# EAGLE design mbed Board (EAGLE 9.2.2)
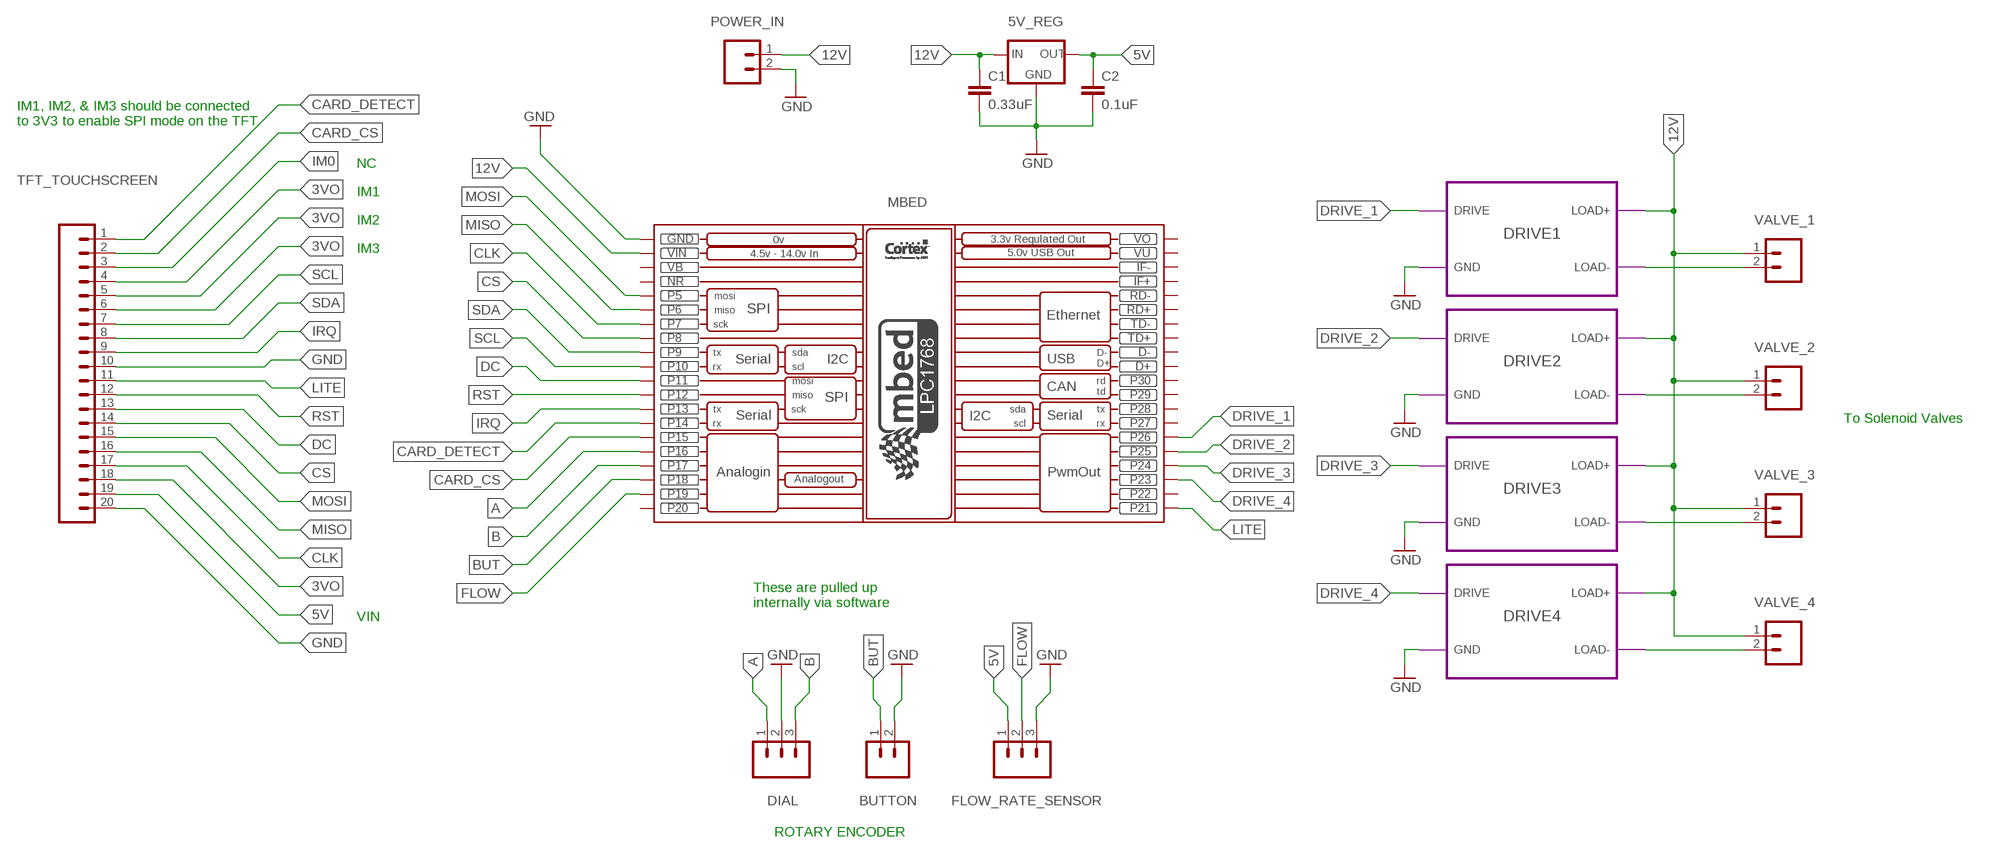
[diagram p0: schematic, sheet 1]

## Parts
5V_REG  5VREG_L7805_SINK  [TO-220-SINK]
BUTTON  M02  [1X02]
C1  0.33uF  CAPPTH  [CAP-PTH-SMALL]
C2  0.1uF  CAPPTH  [CAP-PTH-SMALL]
DIAL  M03  [1X03]
FLOW_RATE_SENSOR  M03  [1X03]
MBED  MBED_NXP_LPC1768  [MBED-KIT]
POWER_IN  M02  [1X02]
TFT_TOUCHSCREEN  M20  [1X20]
VALVE_1  M02  [1X02]
VALVE_2  M02  [1X02]
VALVE_3  M02  [1X02]
VALVE_4  M02  [1X02]

## Module instances
DRIVE1 = DRIVE
DRIVE2 = DRIVE
DRIVE3 = DRIVE
DRIVE4 = DRIVE

## Nets
3VO: TFT_TOUCHSCREEN.4 TFT_TOUCHSCREEN.5 TFT_TOUCHSCREEN.6 TFT_TOUCHSCREEN.18
5V: 5V_REG.3(OUT) C2.1 FLOW_RATE_SENSOR.1 TFT_TOUCHSCREEN.19
12V: 5V_REG.1(IN) C1.1 MBED.VIN POWER_IN.1 VALVE_1.1 VALVE_2.1 VALVE_3.1 VALVE_4.1 ; port DRIVE4.LOAD+ DRIVE3.LOAD+ DRIVE2.LOAD+ DRIVE1.LOAD+
A: DIAL.1 MBED.P$16(P16)
B: DIAL.3 MBED.P$17(P17)
BUT: BUTTON.1 MBED.P$18(P18)
CARD_CS: MBED.P$15(P15) TFT_TOUCHSCREEN.2
CARD_DETECT: MBED.P$14(P14) TFT_TOUCHSCREEN.1
CLK: MBED.P$7(P7) TFT_TOUCHSCREEN.17
CS: MBED.P$8(P8) TFT_TOUCHSCREEN.14
DC: MBED.P$11(P11) TFT_TOUCHSCREEN.13
DRIVE_1: MBED.P$26(P26) ; port DRIVE1.DRIVE
DRIVE_2: MBED.P$25(P25) ; port DRIVE2.DRIVE
DRIVE_3: MBED.P$24(P24) ; port DRIVE3.DRIVE
DRIVE_4: MBED.P$23(P23) ; port DRIVE4.DRIVE
FLOW: FLOW_RATE_SENSOR.2 MBED.P$19(P19)
GND: 5V_REG.2(GND) BUTTON.2 C1.2 C2.2 DIAL.2 FLOW_RATE_SENSOR.3 MBED.GND POWER_IN.2 TFT_TOUCHSCREEN.10 TFT_TOUCHSCREEN.20 ; port DRIVE1.GND DRIVE2.GND DRIVE3.GND DRIVE4.GND
IM0: TFT_TOUCHSCREEN.3
IRQ: MBED.P$13(P13) TFT_TOUCHSCREEN.9
LITE: MBED.P$21(P21) TFT_TOUCHSCREEN.11
MISO: MBED.P$6(P6) TFT_TOUCHSCREEN.16
MOSI: MBED.P$5(P5) TFT_TOUCHSCREEN.15
N$2: VALVE_2.2 ; port DRIVE2.LOAD-
N$3: VALVE_3.2 ; port DRIVE3.LOAD-
N$4: VALVE_4.2 ; port DRIVE4.LOAD-
N$5: VALVE_1.2 ; port DRIVE1.LOAD-
RST: MBED.P$12(P12) TFT_TOUCHSCREEN.12
SCL: MBED.P$10(P10) TFT_TOUCHSCREEN.7
SDA: MBED.P$9(P9) TFT_TOUCHSCREEN.8
Unconnected: MBED.D+ MBED.D- MBED.IF+ MBED.IF- MBED.P$20(P20) MBED.P$22(P22) MBED.P$27(P27) MBED.P$28(P28) MBED.P$29(P29) MBED.P$30(P30) MBED.RD+ MBED.RD- MBED.TD+ MBED.TD-

## Notes on the sheet
- IM1, IM2, & IM3 should be connected
  to 3V3 to enable SPI mode on the TFT
- NC
- IM1
- IM2
- IM3
- To Solenoid Valves
- These are pulled up
  internally via software
- VIN
- ROTARY ENCODER

## Power pins joined to a net without a drawn wire
NR: MBED.NR
VB: MBED.VB
VO: MBED.VOUT(VO)
VU: MBED.VU

## Library data of the parts
5V_REG = HyTechDevices:5VREG_L7805: Voltage Regulator Switching 5v regulator Datasheet <http://power.murata.com/data/power/oki-78sr.pdf> Standard 7805 5V regulator. IGO (Input Ground Output). Spark Fun Electronics SKU : COM-00107 Datasheet <http://www.mouser.com/ds/2/308/MC7800-D-94905.pdf>
BUTTON POWER_IN VALVE_1-VALVE_4 = HyTechDevices:M02: Standard 2-pin 0.1" header. NOTES ON THE VARIANTS LOCK and LOCK_LONGPADS... This footprint was designed to help hold the alignment of a through-hole component (i.e. 6-pin header) while soldering it into place. You may notice that each hole has been shifted either up or down by 0.005 of an inch from it's more standard position (which is a perfectly straight line). This slight alteration caused the pins (the squares in the middle) to touch the edges of the holes. Because they are alternating, it causes a "brace" to hold the component in place. 0.005 has proven to be the perfect amount of "off-center" position when using our standard breakaway headers. Although looks a little odd when you look at the bare footprint, once you have a header in there, the alteration is very hard to notice. Also,if you push a header all the way into place, it is covered up entirely on the bottom side. This idea of altering the position of holes to aid alignment will be further integrated into the Sparkfun Library for other footprints. It can help hold any component with 3 or more connection pins. Note: The Sparkfun version includes many other packages including surface mount that may be of future interest. Source: Sparkfun <https://github.com/sparkfun/SparkFun-Eagle-Libraries>
C1 C2 = HyTechDevices:CAP: Capacitor Standard 0603 ceramic capacitor, and 0.1" leaded capacitor.
DIAL FLOW_RATE_SENSOR = HyTechDevices:M03: Standard 3-pin 0.1" header.
MBED = mbed:MBED_NXP_LPC1768: Mbed LPC1768 - ARM CORTEX v2.1 * Schematic symbol is now placed in eagles's default raster. *The pads diameter are suitable for routing between mbed pins * mbed pads are 0.8 mm drill diameter. --------------------------------------------- Created by: Mohamed Yousry *Alexandria, Egypt *Email: mohamed.yousry@ieeegoldegypt.org
TFT_TOUCHSCREEN = HyTechDevices:M20: 1x20 .1" header This is just like the LOCK variant in that the holes are staggared by 5 mil, but except for the last two holes. They are not altered from the "standard" footprint layout. This is used for a special purpose on the layout of our Graphic LCD Backpack. Make sure you want to use this device before selecting it for you project! Source: Sparkfun <https://github.com/sparkfun/SparkFun-Eagle-Libraries>

## Module DRIVE
Ports: DRIVE(in) GND(pwr) LOAD+(pwr) LOAD-(pwr)
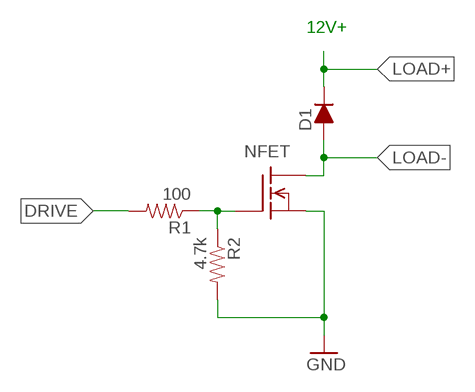
[diagram p1: schematic, module DRIVE, sheet 1]

### Parts
D1  DIODEDO-41  [DO-41]
NFET  N-CHANNEL_MOSFETGENERIC  [TO-220-SINK]
R1  100  RESISTORPTH-1/4W  [AXIAL-0.4]
R2  4.7k  RESISTORPTH-1/4W  [AXIAL-0.4]

### Nets
DRIVE: R1.P$2
GND: NFET.3(S) R2.P$2
LOAD+: D1.C
LOAD-: D1.A NFET.2(D)
N$4: NFET.1(G) R1.P$1 R2.P$1

### Notes on the sheet
- 12V+

### Library data of the parts
D1 = HyTechDevices:DIODE: DIODE general purpose rectifier
NFET = HyTechDevices:N-CHANNEL_MOSFET: Generic N-Channel MOSFET; _EXTERNAL_: 1
R1 R2 = HyTechDevices:RESISTOR: Resistor Basic schematic elements and footprints for 0603, 1206, and PTH resistors.

## Board
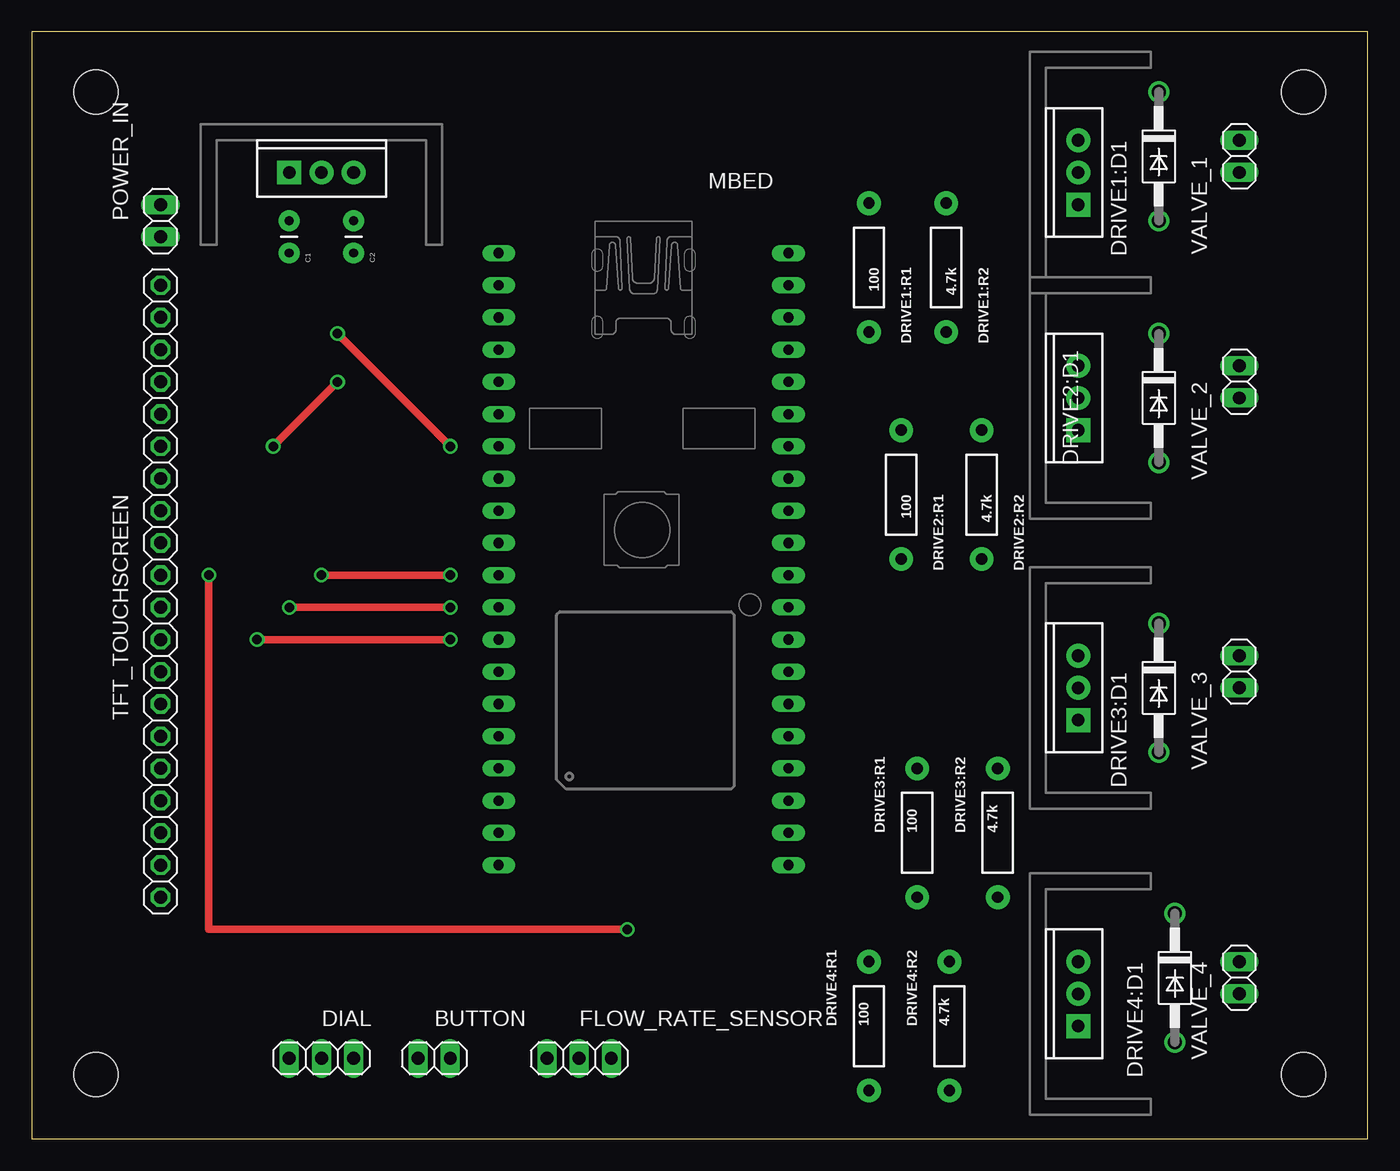
[diagram p2: board, top side]
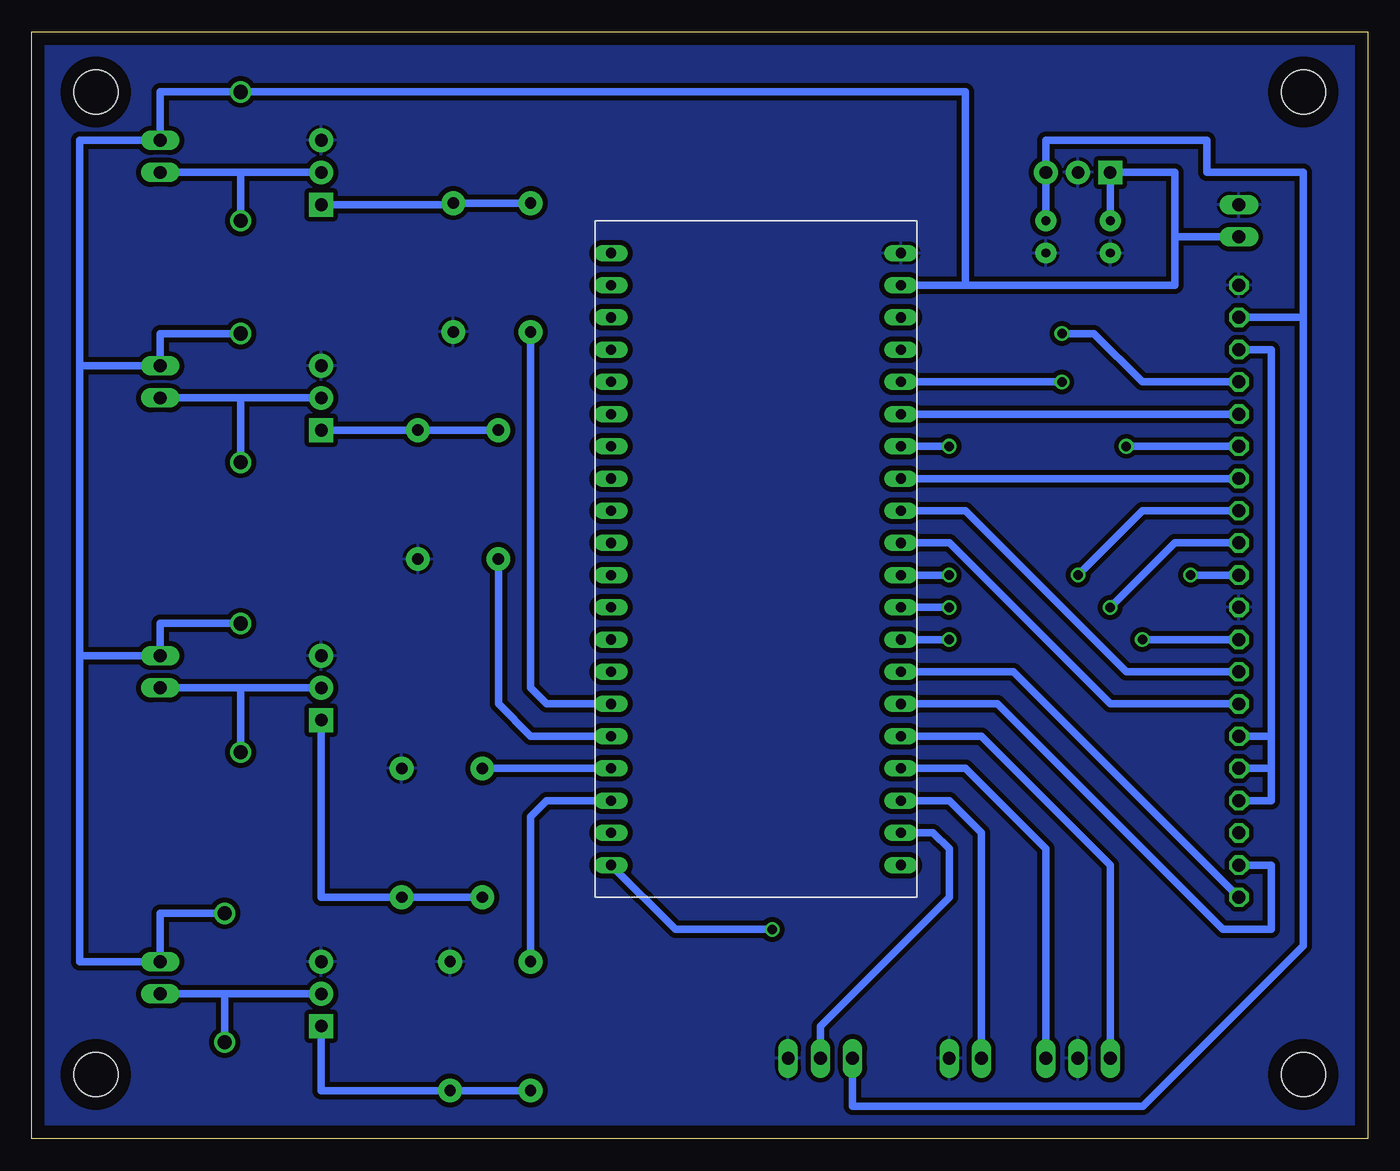
[diagram p3: board, bottom side, seen from below]

Size 105.39 x 87.3 mm. Coordinates in mm from the lower left corner, seen from the top.
Outline: 0,0 105.39,0 105.39,87.3 0,87.3 0,0
Copper layers (1*16): Top 0.035mm / dielectric 1.5mm / Bottom 0.035mm
Design rules "default *": minimum track width 6mil, minimum drill 0.35mm, track to track 15mil, track to pad 15mil, pad to pad 15mil, via to via 15mil, smd to smd 15mil, copper to edge 40mil, drill to drill 6mil, minimum pad ring 10mil, minimum via ring 8mil, stop-mask expansion 4mil, vias tented up to drill 0mil, thermal gap 10mil
Holes 3.5 mm at 5.08,82.55 100.33,82.55 100.33,5.08 5.08,5.08

### Footprints (pad centres in the part's own frame; a part is rotated, then mirrored left to right if it is on the bottom)
TO-220-SINK = drill 1 pad 1.88 square: 1 -2.54,0 | drill 1 pad 1.88: 2 0,0; 3 2.54,0
1X02 = drill 1.016 long: 1 -1.27,0; 2 1.27,0
CAP-PTH-SMALL = drill 0.7 pad 1.651: 1 0,0; 2 2.54,0
1X03 = drill 1.016 long: 1 -2.54,0; 2 0,0; 3 2.54,0
DO-41 = drill 1.118: A 5.08,0; C -5.08,0
AXIAL-0.4 = drill 0.9 pad 1.88: P$1 -5.08,0; P$2 5.08,0
MBED-KIT = drill 0.8 long: D+ 11.43,1.27; D- 11.43,3.81; GND -11.43,24.13; IF+ 11.43,16.51; IF- 11.43,19.05; NR -11.43,16.51; P$5 -11.43,13.97; P$6 -11.43,11.43; P$7 -11.43,8.89; P$8 -11.43,6.35; P$9 -11.43,3.81; P$10 -11.43,1.27; P$11 -11.43,-1.27; P$12 -11.43,-3.81; P$13 -11.43,-6.35; P$14 -11.43,-8.89; P$15 -11.43,-11.43; P$16 -11.43,-13.97; P$17 -11.43,-16.51; P$18 -11.43,-19.05; P$19 -11.43,-21.59; P$20 -11.43,-24.13; P$21 11.43,-24.13; P$22 11.43,-21.59; P$23 11.43,-19.05; P$24 11.43,-16.51; P$25 11.43,-13.97; P$26 11.43,-11.43; P$27 11.43,-8.89; P$28 11.43,-6.35; P$29 11.43,-3.81; P$30 11.43,-1.27; RD+ 11.43,11.43; RD- 11.43,13.97; TD+ 11.43,6.35; TD- 11.43,8.89; VB -11.43,19.05; VIN -11.43,21.59; VOUT 11.43,24.13; VU 11.43,21.59
1X20 = drill 1.016 octagon: 1 0,0; 2 2.54,0; 3 5.08,0; 4 7.62,0; 5 10.16,0; 6 12.7,0; 7 15.24,0; 8 17.78,0; 9 20.32,0; 10 22.86,0; 11 25.4,0; 12 27.94,0; 13 30.48,0; 14 33.02,0; 15 35.56,0; 16 38.1,0; 17 40.64,0; 18 43.18,0; 19 45.72,0; 20 48.26,0

### Placement (x,y rotation side)
5V_REG  22.86,76.2 0 top
BUTTON  31.75,6.35 0 top
C1  20.32,72.39 270 top
C2  25.4,72.39 270 top
DIAL  22.86,6.35 0 top
DRIVE1:D1  [DO-41]  88.9,77.47 270 top
DRIVE1:NFET  N-CHANNEL_MOSFETGENERIC  [TO-220-SINK]  82.55,76.2 90 top
DRIVE1:R1  100  [AXIAL-0.4]  66.04,68.71 270 top
DRIVE1:R2  4.7k  [AXIAL-0.4]  72.14,68.71 270 top
DRIVE2:D1  [DO-41]  88.9,58.42 270 top
DRIVE2:NFET  N-CHANNEL_MOSFETGENERIC  [TO-220-SINK]  82.55,58.42 90 top
DRIVE2:R1  100  [AXIAL-0.4]  68.58,50.8 270 top
DRIVE2:R2  4.7k  [AXIAL-0.4]  74.93,50.8 270 top
DRIVE3:D1  [DO-41]  88.9,35.56 270 top
DRIVE3:NFET  N-CHANNEL_MOSFETGENERIC  [TO-220-SINK]  82.55,35.56 90 top
DRIVE3:R1  100  [AXIAL-0.4]  69.85,24.13 90 top
DRIVE3:R2  4.7k  [AXIAL-0.4]  76.2,24.13 90 top
DRIVE4:D1  [DO-41]  90.17,12.7 270 top
DRIVE4:NFET  N-CHANNEL_MOSFETGENERIC  [TO-220-SINK]  82.55,11.43 90 top
DRIVE4:R1  100  [AXIAL-0.4]  66.04,8.89 90 top
DRIVE4:R2  4.7k  [AXIAL-0.4]  72.39,8.89 90 top
FLOW_RATE_SENSOR  43.18,6.35 0 top
MBED  48.26,45.72 0 top
POWER_IN  10.16,72.39 90 top
TFT_TOUCHSCREEN  10.16,19.05 90 top
VALVE_1  95.25,77.47 270 top
VALVE_2  95.25,59.69 270 top
VALVE_3  95.25,36.83 270 top
VALVE_4  95.25,12.7 270 top

### Tracks (layer width: path | path; a pad name or v marks a point on that pad's centre or on a via)
3VO
  Bottom 0.61: TFT_TOUCHSCREEN.18 7.62,62.23 7.62,31.75 | 7.62,31.75 TFT_TOUCHSCREEN.6 | 7.62,31.75 7.62,29.21 | 7.62,29.21 7.62,26.67 TFT_TOUCHSCREEN.4 | 7.62,29.21 TFT_TOUCHSCREEN.5
5V
  Bottom 0.61: C2.1 5V_REG.3 25.4,78.74 12.7,78.74 12.7,76.2 5.08,76.2 5.08,64.77 | TFT_TOUCHSCREEN.19 5.08,64.77 | 5.08,64.77 5.08,15.24 17.73,2.59 40.64,2.59 FLOW_RATE_SENSOR.1
12V
  Bottom 0.61: C1.1 5V_REG.1 15.24,76.2 15.24,71.12 | 15.24,71.12 15.24,67.31 MBED.VIN 31.75,67.31 31.75,82.55 DRIVE1:D1.C 95.25,82.55 VALVE_1.1 101.6,78.74 101.6,60.96 | 101.6,60.96 101.6,38.1 | 101.6,38.1 101.6,13.97 VALVE_4.1 95.25,17.78 DRIVE4:D1.C | 101.6,38.1 VALVE_3.1 95.25,40.64 DRIVE3:D1.C | 101.6,60.96 VALVE_2.1 95.25,63.5 DRIVE2:D1.C | POWER_IN.1 15.24,71.12
A
  Bottom 0.61: DIAL.1 20.32,21.59 30.48,31.75 MBED.P$16
B
  Bottom 0.61: MBED.P$17 31.75,29.21 25.4,22.86 DIAL.3
BUT
  Bottom 0.61: BUTTON.1 30.48,24.13 33.02,26.67 MBED.P$18
CARD_CS
  Bottom 0.61: TFT_TOUCHSCREEN.2 7.62,21.59 7.62,16.51 11.43,16.51 29.21,34.29 MBED.P$15
CARD_DETECT
  Bottom 0.61: TFT_TOUCHSCREEN.1 27.94,36.83 MBED.P$14
CLK  (via drill 0.75)
  Top 0.61: v33.02,54.61 v24.13,63.5
  Bottom 0.61: TFT_TOUCHSCREEN.17 17.78,59.69 21.59,63.5 v24.13,63.5 | v33.02,54.61 MBED.P$7
CS
  Bottom 0.61: TFT_TOUCHSCREEN.14 MBED.P$8
DC  (via drill 0.75)
  Top 0.61: v22.86,44.45 v33.02,44.45
  Bottom 0.61: TFT_TOUCHSCREEN.13 17.78,49.53 v22.86,44.45 | v33.02,44.45 MBED.P$11
DRIVE1:N$4
  Bottom 0.61: DRIVE1:R1.P$1 DRIVE1:R2.P$1 72.26,73.66 DRIVE1:NFET.1
DRIVE2:N$4
  Bottom 0.61: DRIVE2:R2.P$1 DRIVE2:R1.P$1 DRIVE2:NFET.1
DRIVE3:N$4
  Bottom 0.61: DRIVE3:R1.P$1 DRIVE3:R2.P$1 82.55,19.05 DRIVE3:NFET.1
DRIVE4:N$4
  Bottom 0.61: DRIVE4:R1.P$1 DRIVE4:R2.P$1 82.55,3.81 DRIVE4:NFET.1
DRIVE_1
  Bottom 0.61: MBED.P$26 64.77,34.29 66.04,35.56 DRIVE1:R1.P$2
DRIVE_2
  Bottom 0.61: MBED.P$25 66.04,31.75 68.58,34.29 DRIVE2:R1.P$2
DRIVE_3
  Bottom 0.61: MBED.P$24 DRIVE3:R1.P$2
DRIVE_4
  Bottom 0.61: MBED.P$23 64.77,26.67 66.04,25.4 DRIVE4:R1.P$2
FLOW
  Bottom 0.61: FLOW_RATE_SENSOR.2 43.18,8.89 33.02,19.05 33.02,22.86 34.29,24.13 MBED.P$19
GND
  pour Bottom: -2.54,90.17 107.95,90.17 107.95,-2.54 -2.54,-2.54
IRQ  (via drill 0.75)
  Top 0.61: v17.78,39.37 v33.02,39.37
  Bottom 0.61: TFT_TOUCHSCREEN.9 v17.78,39.37 | v33.02,39.37 MBED.P$13
LITE  (via drill 0.75)
  Top 0.61: v13.97,44.45 13.97,16.51 v46.99,16.51
  Bottom 0.61: TFT_TOUCHSCREEN.11 v13.97,44.45 | v46.99,16.51 54.61,16.51 MBED.P$21
MISO
  Bottom 0.61: TFT_TOUCHSCREEN.16 MBED.P$6
MOSI  (via drill 0.75)
  Top 0.61: v24.13,59.69 v19.05,54.61
  Bottom 0.61: TFT_TOUCHSCREEN.15 v19.05,54.61 | v24.13,59.69 MBED.P$5
N$2
  Bottom 0.61: DRIVE2:NFET.2 88.9,58.42 | 88.9,58.42 VALVE_2.2 | DRIVE2:D1.A 88.9,58.42
N$3
  Bottom 0.61: DRIVE3:NFET.2 88.9,35.56 | 88.9,35.56 DRIVE3:D1.A | 88.9,35.56 VALVE_3.2
N$4
  Bottom 0.61: DRIVE4:NFET.2 90.17,11.43 | 90.17,11.43 DRIVE4:D1.A | 90.17,11.43 VALVE_4.2
N$5
  Bottom 0.61: DRIVE1:NFET.2 88.9,76.2 | 88.9,76.2 VALVE_1.2 | DRIVE1:D1.A 88.9,76.2
RST  (via drill 0.75)
  Top 0.61: v20.32,41.91 v33.02,41.91
  Bottom 0.61: TFT_TOUCHSCREEN.12 15.24,46.99 v20.32,41.91 | v33.02,41.91 MBED.P$12
SCL
  Bottom 0.61: TFT_TOUCHSCREEN.7 20.32,34.29 33.02,46.99 MBED.P$10
SDA
  Bottom 0.61: TFT_TOUCHSCREEN.8 19.05,36.83 31.75,49.53 MBED.P$9